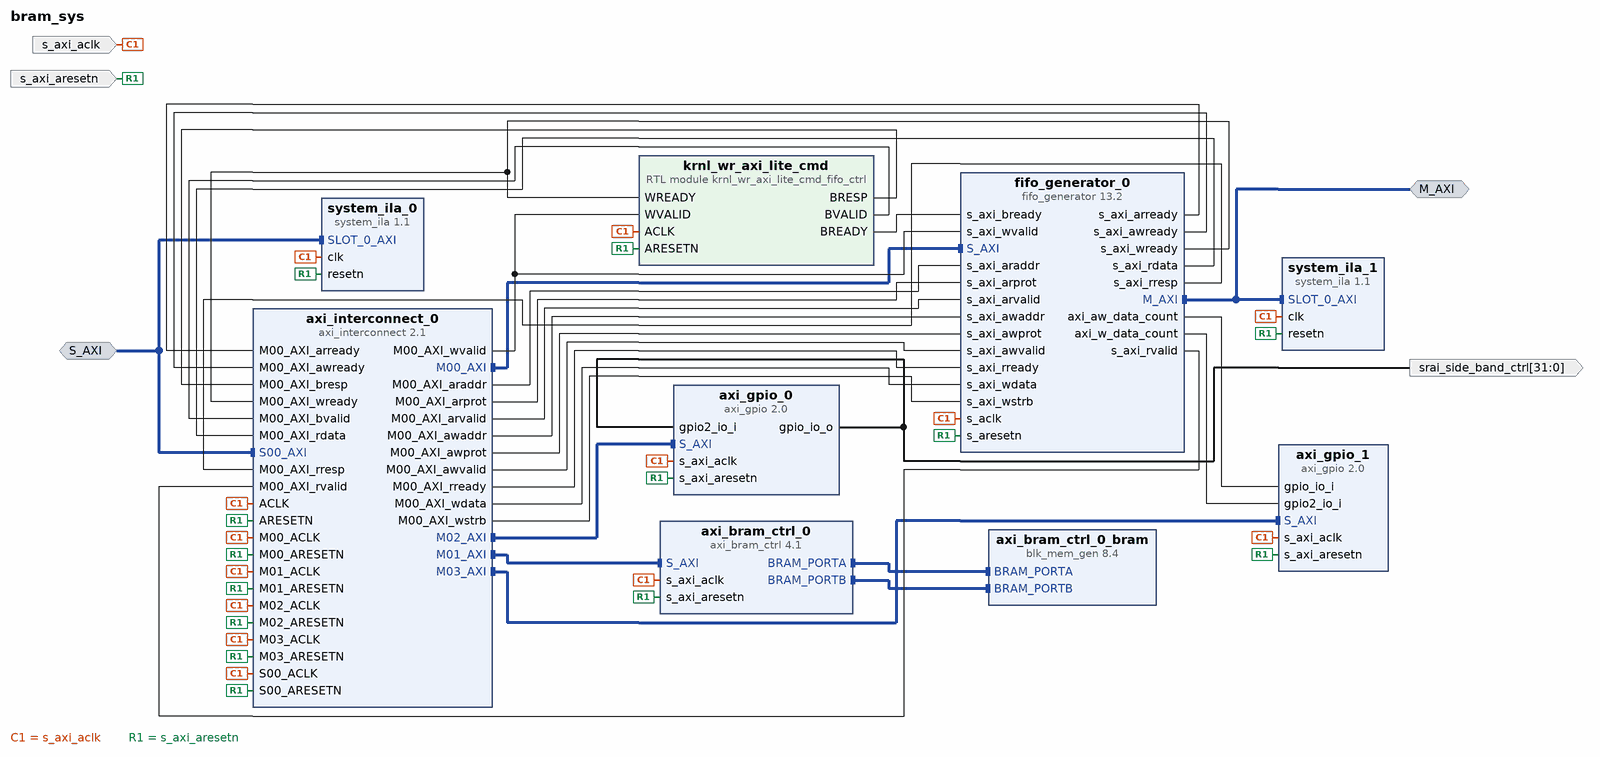
[diagram p0: block diagram of the top level]
# Vivado block design bram_sys, xcu250-figd2104-2L-e, Vivado 2019.1
create_bd_design bram_sys

create_bd_intf_port -mode Master -vlnv xilinx.com:interface:aximm_rtl:1.0 M_AXI
set_property -dict [list \
  CONFIG.ADDR_WIDTH 32 \
  CONFIG.DATA_WIDTH 32 \
  CONFIG.NUM_READ_OUTSTANDING 2 \
  CONFIG.NUM_WRITE_OUTSTANDING 256 \
  CONFIG.PROTOCOL AXI4LITE \
] [get_bd_intf_ports M_AXI]
create_bd_intf_port -mode Slave -vlnv xilinx.com:interface:aximm_rtl:1.0 S_AXI
set_property -dict [list \
  CONFIG.ADDR_WIDTH 32 \
  CONFIG.ARUSER_WIDTH 0 \
  CONFIG.AWUSER_WIDTH 0 \
  CONFIG.BUSER_WIDTH 0 \
  CONFIG.DATA_WIDTH 32 \
  CONFIG.HAS_BRESP 1 \
  CONFIG.HAS_BURST 1 \
  CONFIG.HAS_CACHE 1 \
  CONFIG.HAS_LOCK 1 \
  CONFIG.HAS_PROT 1 \
  CONFIG.HAS_QOS 0 \
  CONFIG.HAS_REGION 0 \
  CONFIG.HAS_RRESP 1 \
  CONFIG.HAS_WSTRB 1 \
  CONFIG.ID_WIDTH 0 \
  CONFIG.MAX_BURST_LENGTH 1 \
  CONFIG.NUM_READ_OUTSTANDING 2 \
  CONFIG.NUM_READ_THREADS 1 \
  CONFIG.NUM_WRITE_OUTSTANDING 256 \
  CONFIG.NUM_WRITE_THREADS 1 \
  CONFIG.PROTOCOL AXI4LITE \
  CONFIG.READ_WRITE_MODE READ_WRITE \
  CONFIG.RUSER_BITS_PER_BYTE 0 \
  CONFIG.RUSER_WIDTH 0 \
  CONFIG.SUPPORTS_NARROW_BURST 0 \
  CONFIG.WUSER_BITS_PER_BYTE 0 \
  CONFIG.WUSER_WIDTH 0 \
] [get_bd_intf_ports S_AXI]
create_bd_port -dir I -type clk s_axi_aclk
set_property -dict {CONFIG.ASSOCIATED_BUSIF S_AXI:M_AXI} [get_bd_ports s_axi_aclk]
create_bd_port -dir I -type rst s_axi_aresetn
create_bd_port -dir O -from 31 -to 0 srai_side_band_ctrl

create_bd_cell -type ip -vlnv xilinx.com:ip:axi_bram_ctrl:4.1 axi_bram_ctrl_0
set_property -dict {CONFIG.PROTOCOL AXI4LITE} [get_bd_cells axi_bram_ctrl_0]
create_bd_cell -type ip -vlnv xilinx.com:ip:blk_mem_gen:8.4 axi_bram_ctrl_0_bram
set_property -dict [list \
  CONFIG.Enable_B Use_ENB_Pin \
  CONFIG.Memory_Type True_Dual_Port_RAM \
  CONFIG.Port_B_Clock 100 \
  CONFIG.Port_B_Enable_Rate 100 \
  CONFIG.Port_B_Write_Rate 50 \
  CONFIG.Use_RSTB_Pin true \
] [get_bd_cells axi_bram_ctrl_0_bram]
create_bd_cell -type ip -vlnv xilinx.com:ip:axi_gpio:2.0 axi_gpio_0
set_property -dict [list \
  CONFIG.C_ALL_INPUTS_2 1 \
  CONFIG.C_ALL_OUTPUTS 1 \
  CONFIG.C_GPIO_WIDTH 32 \
  CONFIG.C_IS_DUAL 1 \
] [get_bd_cells axi_gpio_0]
create_bd_cell -type ip -vlnv xilinx.com:ip:axi_gpio:2.0 axi_gpio_1
set_property -dict [list \
  CONFIG.C_ALL_INPUTS 1 \
  CONFIG.C_ALL_INPUTS_2 1 \
  CONFIG.C_GPIO2_WIDTH 11 \
  CONFIG.C_GPIO_WIDTH 11 \
  CONFIG.C_IS_DUAL 1 \
] [get_bd_cells axi_gpio_1]
create_bd_cell -type ip -vlnv xilinx.com:ip:axi_interconnect:2.1 axi_interconnect_0
set_property -dict {CONFIG.M00_HAS_DATA_FIFO 0 CONFIG.M00_HAS_REGSLICE 4 CONFIG.NUM_MI 4} [get_bd_cells axi_interconnect_0]
create_bd_cell -type ip -vlnv xilinx.com:ip:fifo_generator:13.2 fifo_generator_0
set_property -dict [list \
  CONFIG.DATA_WIDTH 32 \
  CONFIG.Enable_Data_Counts_rach false \
  CONFIG.Enable_Data_Counts_wach true \
  CONFIG.Enable_Data_Counts_wdch true \
  CONFIG.Enable_Data_Counts_wrch false \
  CONFIG.FIFO_Implementation_axis Common_Clock_Builtin_FIFO \
  CONFIG.FIFO_Implementation_rach Common_Clock_Distributed_RAM \
  CONFIG.FIFO_Implementation_rdch Common_Clock_Builtin_FIFO \
  CONFIG.FIFO_Implementation_wach Common_Clock_Block_RAM \
  CONFIG.FIFO_Implementation_wdch Common_Clock_Block_RAM \
  CONFIG.FIFO_Implementation_wrch Common_Clock_Block_RAM \
  CONFIG.INTERFACE_TYPE AXI_MEMORY_MAPPED \
  CONFIG.Input_Depth_rach 1024 \
  CONFIG.Input_Depth_wach 1024 \
  CONFIG.Input_Depth_wrch 1024 \
  CONFIG.PROTOCOL AXI4_Lite \
  CONFIG.rach_type Pass_Through_Wire \
  CONFIG.rdch_type Pass_Through_Wire \
  CONFIG.wach_type FIFO \
  CONFIG.wrch_type Pass_Through_Wire \
] [get_bd_cells fifo_generator_0]
create_bd_cell -type module -reference krnl_wr_axi_lite_cmd_fifo_ctrl krnl_wr_axi_lite_cmd
create_bd_cell -type ip -vlnv xilinx.com:ip:system_ila:1.1 system_ila_0
set_property -dict [list \
  CONFIG.C_INPUT_PIPE_STAGES 2 \
  CONFIG.C_SLOT_0_AXI_R_SEL_TRIG 0 \
  CONFIG.C_SLOT_0_AXI_W_SEL_TRIG 0 \
  CONFIG.C_SLOT_0_TXN_CNTR_EN 0 \
] [get_bd_cells system_ila_0]
create_bd_cell -type ip -vlnv xilinx.com:ip:system_ila:1.1 system_ila_1
set_property -dict [list \
  CONFIG.C_INPUT_PIPE_STAGES 2 \
  CONFIG.C_SLOT_0_AXI_R_SEL_TRIG 0 \
  CONFIG.C_SLOT_0_AXI_W_SEL_TRIG 0 \
  CONFIG.C_SLOT_0_TXN_CNTR_EN 0 \
] [get_bd_cells system_ila_1]

# ---- connections ----

connect_bd_intf_net [get_bd_intf_pins axi_bram_ctrl_0/BRAM_PORTA] [get_bd_intf_pins axi_bram_ctrl_0_bram/BRAM_PORTA]
connect_bd_intf_net [get_bd_intf_pins axi_bram_ctrl_0/BRAM_PORTB] [get_bd_intf_pins axi_bram_ctrl_0_bram/BRAM_PORTB]
connect_bd_intf_net [get_bd_intf_pins axi_interconnect_0/M00_AXI] [get_bd_intf_pins fifo_generator_0/S_AXI]
connect_bd_intf_net [get_bd_intf_ports M_AXI] [get_bd_intf_pins fifo_generator_0/M_AXI]
connect_bd_intf_net [get_bd_intf_ports M_AXI] [get_bd_intf_pins system_ila_1/SLOT_0_AXI]
connect_bd_intf_net [get_bd_intf_ports S_AXI] [get_bd_intf_pins axi_interconnect_0/S00_AXI]
connect_bd_intf_net [get_bd_intf_ports S_AXI] [get_bd_intf_pins system_ila_0/SLOT_0_AXI]
connect_bd_intf_net [get_bd_intf_pins axi_gpio_1/S_AXI] [get_bd_intf_pins axi_interconnect_0/M03_AXI]
connect_bd_intf_net [get_bd_intf_pins axi_bram_ctrl_0/S_AXI] [get_bd_intf_pins axi_interconnect_0/M01_AXI]
connect_bd_intf_net [get_bd_intf_pins axi_gpio_0/S_AXI] [get_bd_intf_pins axi_interconnect_0/M02_AXI]
connect_bd_net -net M00_AXI_arready_1 [get_bd_pins fifo_generator_0/s_axi_arready] [get_bd_pins axi_interconnect_0/M00_AXI_arready]
connect_bd_net -net M00_AXI_awready_1 [get_bd_pins fifo_generator_0/s_axi_awready] [get_bd_pins axi_interconnect_0/M00_AXI_awready]
connect_bd_net -net M00_AXI_bresp_1 [get_bd_pins krnl_wr_axi_lite_cmd/BRESP] [get_bd_pins axi_interconnect_0/M00_AXI_bresp]
connect_bd_net -net M00_AXI_bvalid_1 [get_bd_pins krnl_wr_axi_lite_cmd/BVALID] [get_bd_pins axi_interconnect_0/M00_AXI_bvalid]
connect_bd_net -net M00_AXI_rdata_1 [get_bd_pins fifo_generator_0/s_axi_rdata] [get_bd_pins axi_interconnect_0/M00_AXI_rdata]
connect_bd_net -net M00_AXI_rresp_1 [get_bd_pins fifo_generator_0/s_axi_rresp] [get_bd_pins axi_interconnect_0/M00_AXI_rresp]
connect_bd_net -net M00_AXI_rvalid_1 [get_bd_pins fifo_generator_0/s_axi_rvalid] [get_bd_pins axi_interconnect_0/M00_AXI_rvalid]
connect_bd_net -net M00_AXI_wready_1 [get_bd_pins fifo_generator_0/s_axi_wready] \
  [get_bd_pins axi_interconnect_0/M00_AXI_wready] [get_bd_pins krnl_wr_axi_lite_cmd/WREADY]
connect_bd_net [get_bd_pins axi_gpio_0/gpio_io_o] [get_bd_ports srai_side_band_ctrl] [get_bd_pins axi_gpio_0/gpio2_io_i]
connect_bd_net [get_bd_pins axi_interconnect_0/M00_AXI_araddr] [get_bd_pins fifo_generator_0/s_axi_araddr]
connect_bd_net [get_bd_pins axi_interconnect_0/M00_AXI_arprot] [get_bd_pins fifo_generator_0/s_axi_arprot]
connect_bd_net [get_bd_pins axi_interconnect_0/M00_AXI_arvalid] [get_bd_pins fifo_generator_0/s_axi_arvalid]
connect_bd_net [get_bd_pins axi_interconnect_0/M00_AXI_awaddr] [get_bd_pins fifo_generator_0/s_axi_awaddr]
connect_bd_net [get_bd_pins axi_interconnect_0/M00_AXI_awprot] [get_bd_pins fifo_generator_0/s_axi_awprot]
connect_bd_net [get_bd_pins axi_interconnect_0/M00_AXI_awvalid] [get_bd_pins fifo_generator_0/s_axi_awvalid]
connect_bd_net [get_bd_pins axi_interconnect_0/M00_AXI_rready] [get_bd_pins fifo_generator_0/s_axi_rready]
connect_bd_net [get_bd_pins axi_interconnect_0/M00_AXI_wdata] [get_bd_pins fifo_generator_0/s_axi_wdata]
connect_bd_net [get_bd_pins axi_interconnect_0/M00_AXI_wstrb] [get_bd_pins fifo_generator_0/s_axi_wstrb]
connect_bd_net [get_bd_pins axi_interconnect_0/M00_AXI_wvalid] [get_bd_pins fifo_generator_0/s_axi_wvalid] [get_bd_pins krnl_wr_axi_lite_cmd/WVALID]
connect_bd_net [get_bd_pins fifo_generator_0/axi_aw_data_count] [get_bd_pins axi_gpio_1/gpio_io_i]
connect_bd_net [get_bd_pins fifo_generator_0/axi_w_data_count] [get_bd_pins axi_gpio_1/gpio2_io_i]
connect_bd_net -net krnl_wr_axi_lite_cmd_1_BREADY [get_bd_pins krnl_wr_axi_lite_cmd/BREADY] [get_bd_pins fifo_generator_0/s_axi_bready]
connect_bd_net -net s_axi_aclk_0_1 [get_bd_ports s_axi_aclk] \
  [get_bd_pins axi_bram_ctrl_0/s_axi_aclk] [get_bd_pins axi_gpio_0/s_axi_aclk] [get_bd_pins axi_gpio_1/s_axi_aclk] \
  [get_bd_pins axi_interconnect_0/ACLK] [get_bd_pins axi_interconnect_0/M00_ACLK] [get_bd_pins axi_interconnect_0/M01_ACLK] \
  [get_bd_pins axi_interconnect_0/M02_ACLK] [get_bd_pins axi_interconnect_0/M03_ACLK] \
  [get_bd_pins axi_interconnect_0/S00_ACLK] [get_bd_pins fifo_generator_0/s_aclk] [get_bd_pins krnl_wr_axi_lite_cmd/ACLK] \
  [get_bd_pins system_ila_0/clk] [get_bd_pins system_ila_1/clk]
connect_bd_net -net s_axi_aresetn_0_1 [get_bd_ports s_axi_aresetn] \
  [get_bd_pins axi_bram_ctrl_0/s_axi_aresetn] [get_bd_pins axi_gpio_0/s_axi_aresetn] [get_bd_pins axi_gpio_1/s_axi_aresetn] \
  [get_bd_pins axi_interconnect_0/ARESETN] [get_bd_pins axi_interconnect_0/M00_ARESETN] \
  [get_bd_pins axi_interconnect_0/M01_ARESETN] [get_bd_pins axi_interconnect_0/M02_ARESETN] \
  [get_bd_pins axi_interconnect_0/M03_ARESETN] [get_bd_pins axi_interconnect_0/S00_ARESETN] \
  [get_bd_pins fifo_generator_0/s_aresetn] [get_bd_pins krnl_wr_axi_lite_cmd/ARESETN] [get_bd_pins system_ila_0/resetn] \
  [get_bd_pins system_ila_1/resetn]

# ---- address map ----
assign_bd_address -offset 0x01800000 -range 32K -target_address_space [get_bd_addr_spaces S_AXI] [get_bd_addr_segs M_AXI/Reg]
assign_bd_address -offset 0x01808000 -range 16K -target_address_space [get_bd_addr_spaces S_AXI] [get_bd_addr_segs axi_bram_ctrl_0/S_AXI/Mem0]
assign_bd_address -offset 0x0180C000 -range 4K -target_address_space [get_bd_addr_spaces S_AXI] [get_bd_addr_segs axi_gpio_0/S_AXI/Reg]
assign_bd_address -offset 0x0180D000 -range 4K -target_address_space [get_bd_addr_spaces S_AXI] [get_bd_addr_segs axi_gpio_1/S_AXI/Reg]

validate_bd_design
save_bd_design
